# Altium project Control_Part_V1.1.PrjPcb
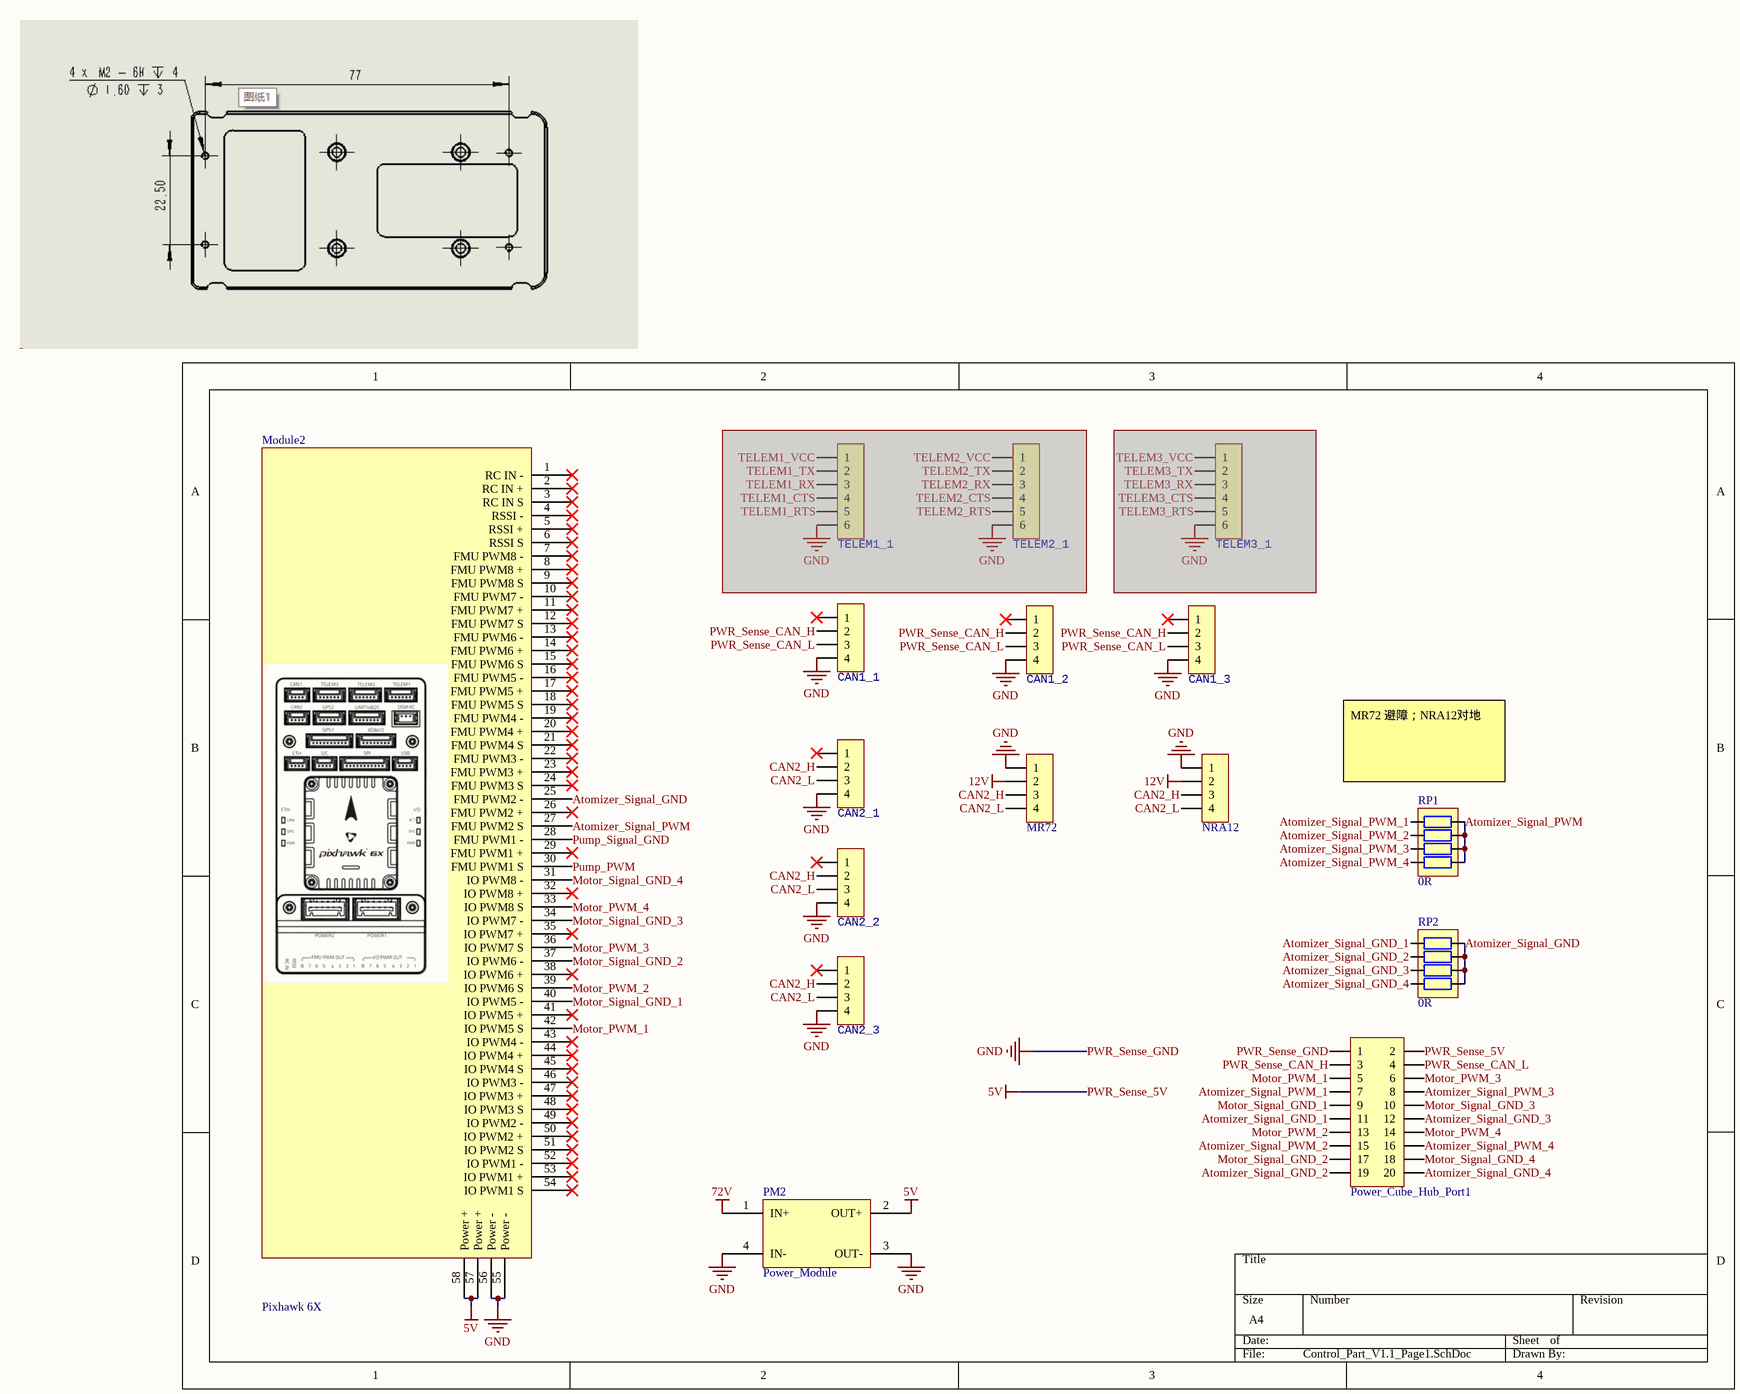
[diagram p0: Control_Part_V1.1_Page1.SchDoc]
2 sheets, 28 parts. Net scope: global (net labels, ports and power ports of the same name join across sheets).
Board file: Control_Part_V1.1.PcbDoc
Sheets:
  Control_Part_V1.1_Page1.SchDoc
  Control_Part_V1.1_Page2.SchDoc

## Sheet Control_Part_V1.1_Page1.SchDoc
size A4; SheetNumber: 1; SheetTotal: 2

### Parts
CAN1_1  HDR-1X4  [GH1.25-LS-4P]  (value not drawn)
CAN1_2  HDR-1X4  [GH1.25-LS-4P]  (value not drawn)
CAN1_3  HDR-1X4  [GH1.25-LS-4P]  (value not drawn)
CAN2_1  HDR-1X4  [GH1.25-LS-4P]  (value not drawn)
CAN2_2  HDR-1X4  [GH1.25-LS-4P]  (value not drawn)
CAN2_3  HDR-1X4  [GH1.25-LS-4P]  (value not drawn)
Module2  Pixhawk 6X  [CUAV_PixhawkV6X]
MR72  HDR-1X4  [KF350-4P]  (value not drawn)
NRA12  HDR-1X4  [KF350-4P]  (value not drawn)
PM2  Power_Module  [PCBComponent_1]
Power_Cube_Hub_Port1  Header 2X10  [IDC2.54-LI-2x10P]  (value not drawn)
RP1  0R  [RCA-8P4R-0603]
RP2  0R  [RCA-8P4R-0603]
TELEM1_1  HDR-1X6  [GH1.25-LS-6P]  (value not drawn)  (masked out: inside a compile mask, not in the netlist)
TELEM2_1  HDR-1X6  [GH1.25-LS-6P]  (value not drawn)  (masked out: inside a compile mask, not in the netlist)
TELEM3_1  HDR-1X6  [GH1.25-LS-6P]  (value not drawn)  (masked out: inside a compile mask, not in the netlist)

### Nets
12V: MR72.2 NRA12.2
72V: PM2.1(IN+)
PWR_Sense_5V: Module2.57(Power_+) Module2.58(Power_+) PM2.2(OUT+) Power_Cube_Hub_Port1.2  [also labelled 5V]
PWR_Sense_GND: CAN1_1.4 CAN1_2.4 CAN1_3.4 CAN2_1.4 CAN2_2.4 CAN2_3.4 Module2.55(Power_-) Module2.56(Power_-) MR72.1 NRA12.1 PM2.3(OUT-) PM2.4(IN-) Power_Cube_Hub_Port1.1  [also labelled GND]
Atomizer_Signal_GND: Module2.25(FMU_PWM2_-) RP2.5 RP2.6 RP2.7 RP2.8
Atomizer_Signal_GND_1: Power_Cube_Hub_Port1.11 RP2.1
Atomizer_Signal_GND_2: Power_Cube_Hub_Port1.19 RP2.2
Atomizer_Signal_GND_3: Power_Cube_Hub_Port1.12 RP2.3
Atomizer_Signal_GND_4: Power_Cube_Hub_Port1.20 RP2.4
Atomizer_Signal_PWM: Module2.27(FMU_PWM2_S) RP1.5 RP1.6 RP1.7 RP1.8
Atomizer_Signal_PWM_1: Power_Cube_Hub_Port1.7 RP1.1
Atomizer_Signal_PWM_2: Power_Cube_Hub_Port1.15 RP1.2
Atomizer_Signal_PWM_3: Power_Cube_Hub_Port1.8 RP1.3
Atomizer_Signal_PWM_4: Power_Cube_Hub_Port1.16 RP1.4
CAN2_H: CAN2_1.2 CAN2_2.2 CAN2_3.2 MR72.3 NRA12.3
CAN2_L: CAN2_1.3 CAN2_2.3 CAN2_3.3 MR72.4 NRA12.4
Motor_PWM_1: Module2.42(IO_PWM5_S) Power_Cube_Hub_Port1.5
Motor_PWM_2: Module2.39(IO_PWM6_S) Power_Cube_Hub_Port1.13
Motor_PWM_3: Module2.36(IO_PWM7_S) Power_Cube_Hub_Port1.6
Motor_PWM_4: Module2.33(IO_PWM8_S) Power_Cube_Hub_Port1.14
Motor_Signal_GND_1: Module2.40(IO_PWM5_-) Power_Cube_Hub_Port1.9
Motor_Signal_GND_2: Module2.37(IO_PWM6_-) Power_Cube_Hub_Port1.17
Motor_Signal_GND_3: Module2.34(IO_PWM7_-) Power_Cube_Hub_Port1.10
Motor_Signal_GND_4: Module2.31(IO_PWM8_-) Power_Cube_Hub_Port1.18
Pump_PWM: Module2.30(FMU_PWM1_S)
Pump_Signal_GND: Module2.28(FMU_PWM1_-)
PWR_Sense_CAN_H: CAN1_1.2 CAN1_2.2 CAN1_3.2 Power_Cube_Hub_Port1.3
PWR_Sense_CAN_L: CAN1_1.3 CAN1_2.3 CAN1_3.3 Power_Cube_Hub_Port1.4

Not connected (* = marked no-connect by the designer): CAN1_1 1*; CAN1_2 1*; CAN1_3 1*; CAN2_1 1*; CAN2_2 1*; CAN2_3 1*; Module2 1(RC_IN_-)* 2(RC_IN_+)* 3(RC_IN_S)* 4(RSSI_-)* 5(RSSI_+)* 6(RSSI_S)* 7(FMU_PWM8_-)* 8(FMU_PWM8_+)* 9(FMU_PWM8_S)* 10(FMU_PWM7_-)* 11(FMU_PWM7_+)* 12(FMU_PWM7_S)* 13(FMU_PWM6_-)* 14(FMU_PWM6_+)* 15(FMU_PWM6_S)* 16(FMU_PWM5_-)* 17(FMU_PWM5_+)* 18(FMU_PWM5_S)* 19(FMU_PWM4_-)* 20(FMU_PWM4_+)* 21(FMU_PWM4_S)* 22(FMU_PWM3_-)* 23(FMU_PWM3_+)* 24(FMU_PWM3_S)* 26(FMU_PWM2_+)* 29(FMU_PWM1_+)* 32(IO_PWM8_+)* 35(IO_PWM7_+)* 38(IO_PWM6_+)* 41(IO_PWM5_+)* 43(IO_PWM4_-)* 44(IO_PWM4_+)* 45(IO_PWM4_S)* 46(IO_PWM3_-)* 47(IO_PWM3_+)* 48(IO_PWM3_S)* 49(IO_PWM2_-)* 50(IO_PWM2_+)* 51(IO_PWM2_S)* 52(IO_PWM1_-)* 53(IO_PWM1_+)* 54(IO_PWM1_S)*

### Notes on the sheet
- (near RP1) MR72 避障；NRA12对地

### Library data of the parts
CAN1_1-CAN1_3 CAN2_1-CAN2_3 MR72 NRA12 = Header 4: 4P接插件; BOM名称: 4P接插件
Power_Cube_Hub_Port1 = Header 10X2: 10*2P接插件; BOM名称: 10*2P接插件
RP1 RP2 = R-8P4R: 贴片网络排阻; BOM名称: 贴片网络排阻
TELEM1_1 TELEM2_1 TELEM3_1 = Header 6: 6P接插件; BOM名称: 6P接插件

## Sheet Control_Part_V1.1_Page2.SchDoc
size A4; SheetNumber: 2; SheetTotal: 2
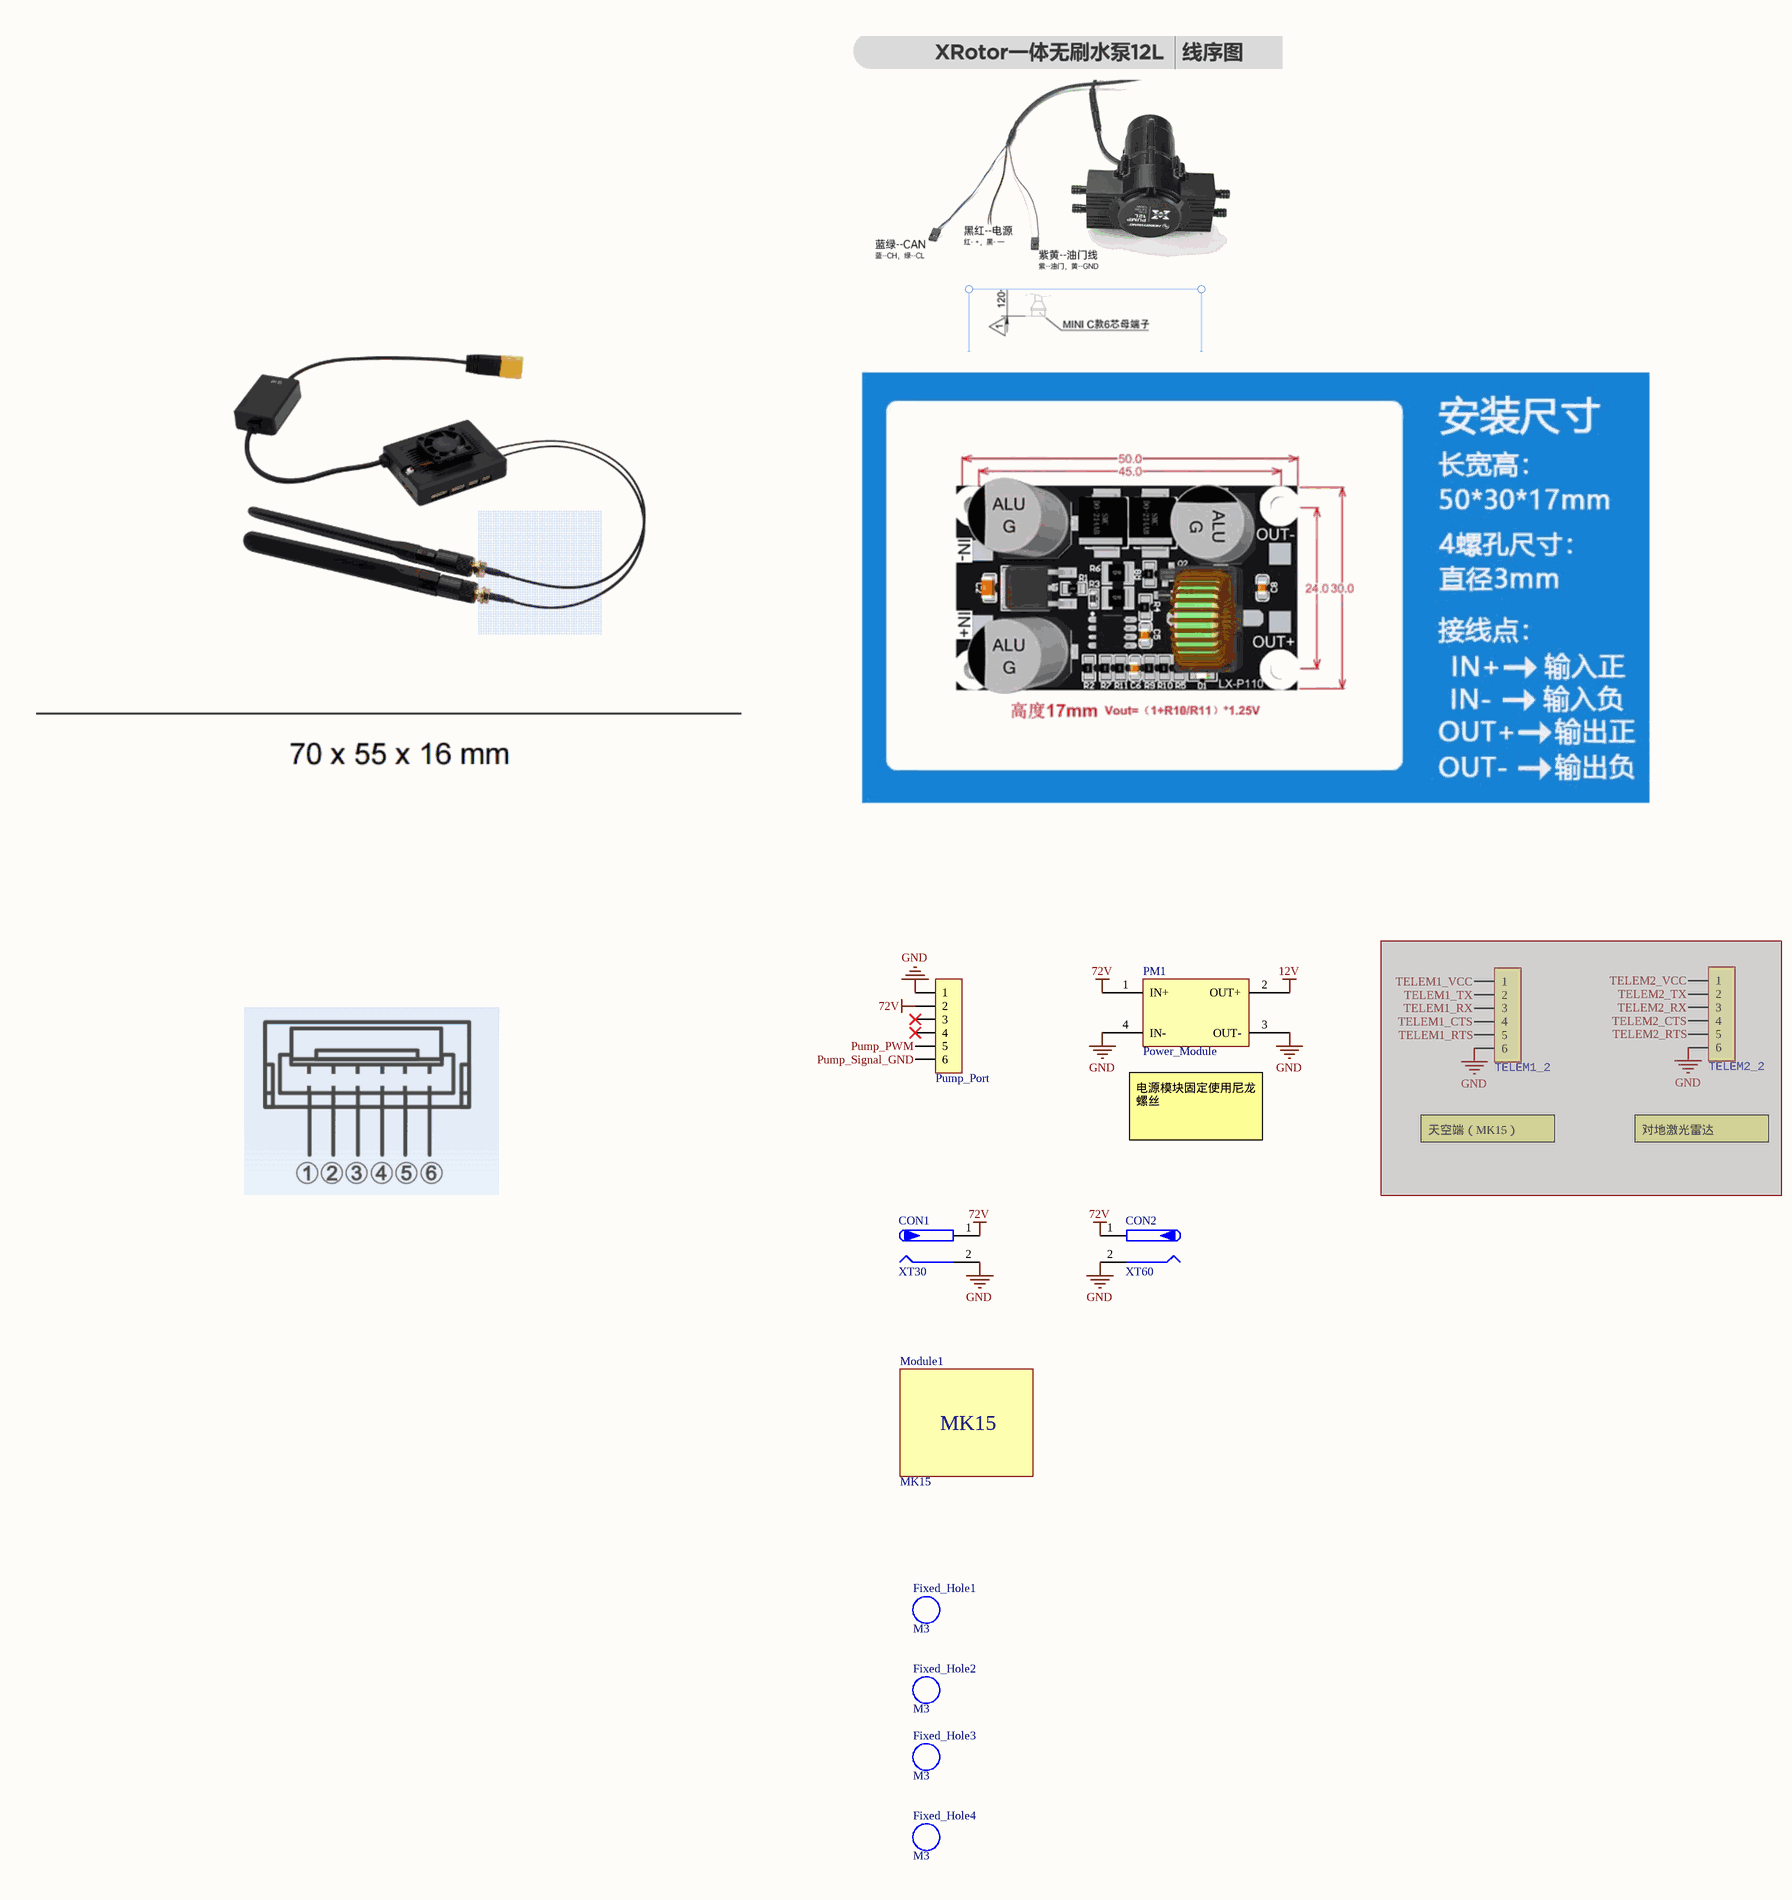
[diagram p1: Control_Part_V1.1_Page2.SchDoc, left]
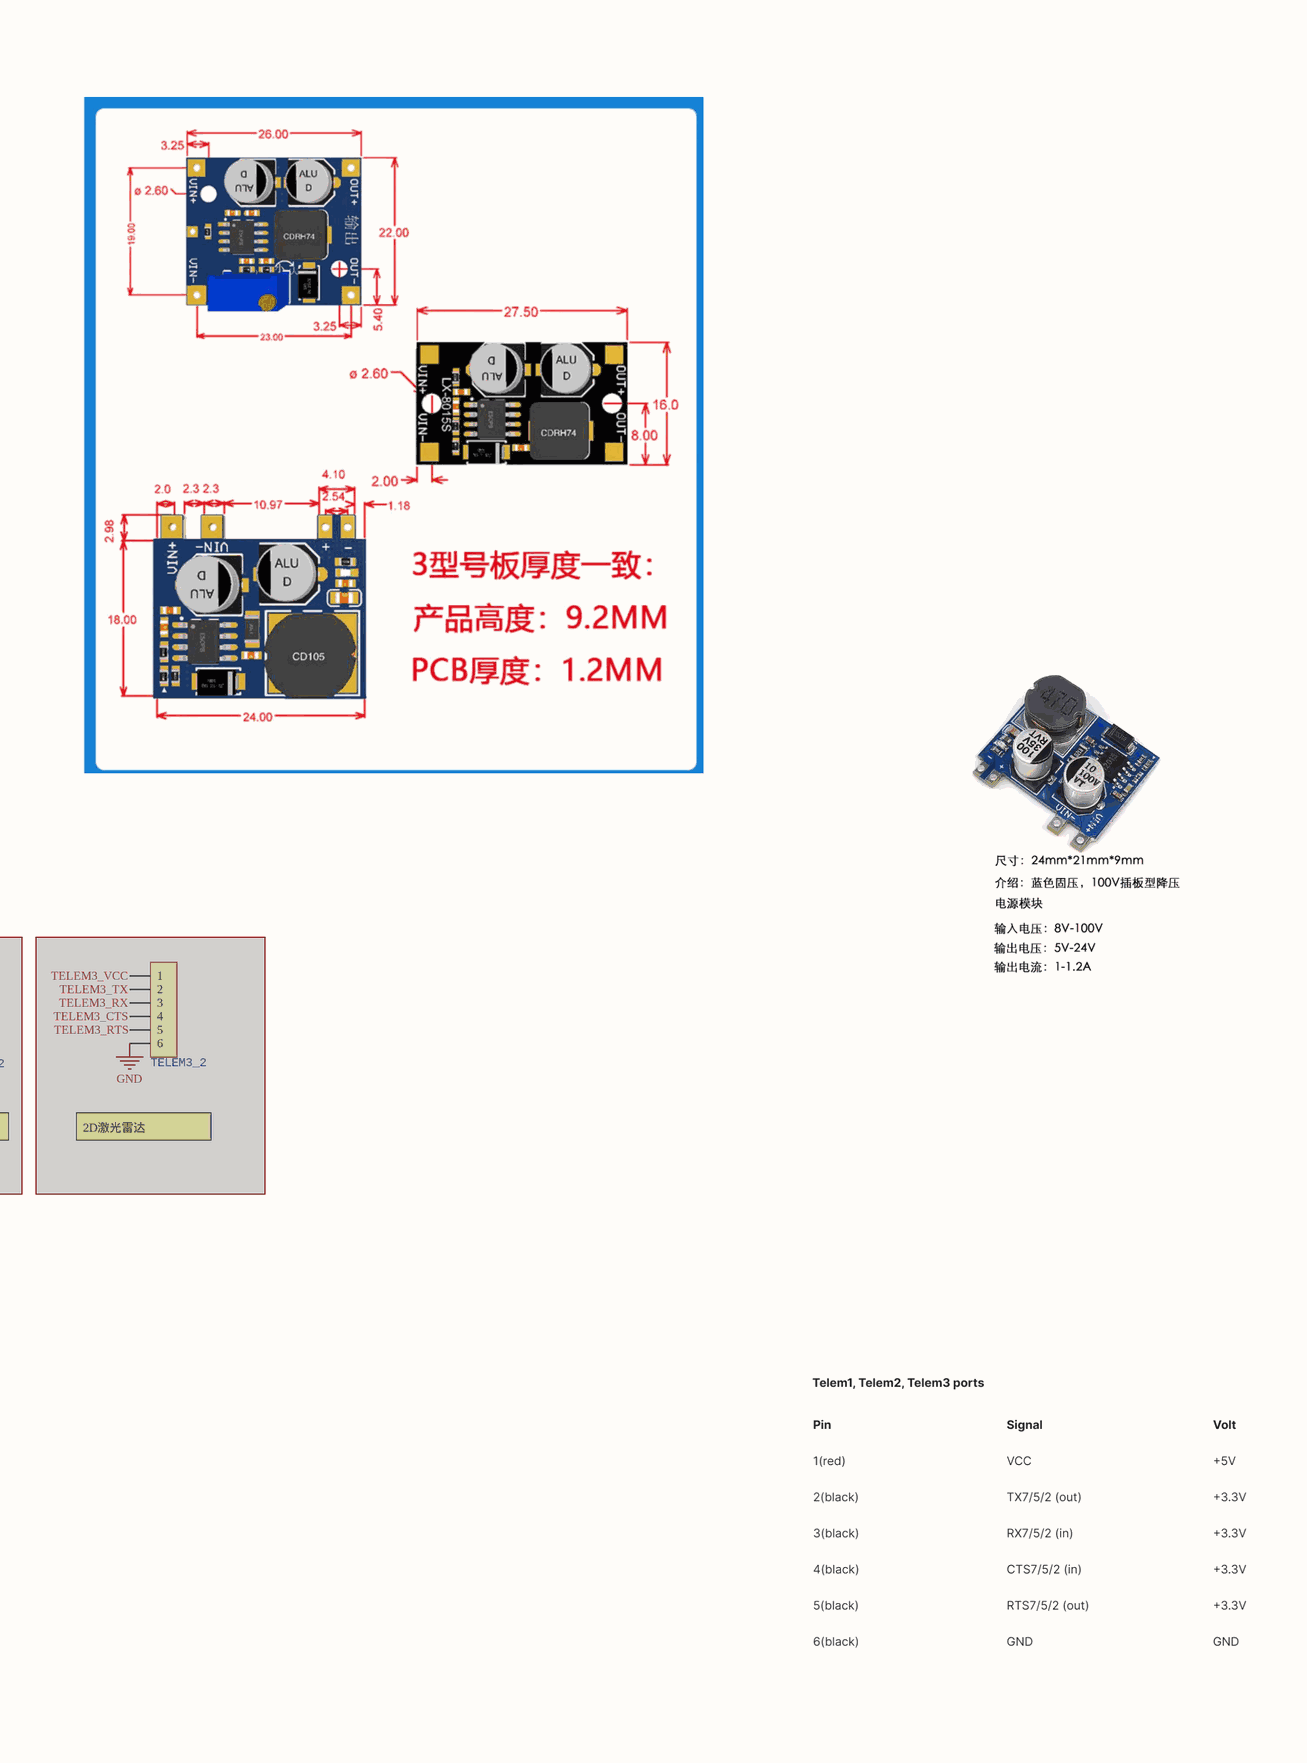
[diagram p2: Control_Part_V1.1_Page2.SchDoc, right]

### Parts
CON1  XT30  [XT30U-M]
CON2  XT60  [TX60U-F]
Fixed_Hole1  M3  [M3 140X350]
Fixed_Hole2  M3  [M3 140X350]
Fixed_Hole3  M3  [M3 140X350]
Fixed_Hole4  M3  [M3 140X350]
Module1  MK15  [MK15]
PM1  Power_Module  [PCBComponent_1]
Pump_Port  HDR-1X6  [HDR2.54-LI-6P]  (value not drawn)
TELEM1_2  HDR-1X6  [GH1.25-LS-6P]  (value not drawn)  (masked out: inside a compile mask, not in the netlist)
TELEM2_2  HDR-1X6  [GH1.25-LS-6P]  (value not drawn)  (masked out: inside a compile mask, not in the netlist)
TELEM3_2  HDR-1X6  [GH1.25-LS-6P]  (value not drawn)  (masked out: inside a compile mask, not in the netlist)

### Nets
12V: PM1.2(OUT+)
72V: CON1.1 CON2.1 PM1.1(IN+) Pump_Port.2
GND: CON1.2 CON2.2 PM1.3(OUT-) PM1.4(IN-) Pump_Port.1  [project net PWR_Sense_GND]
Pump_PWM: Pump_Port.5
Pump_Signal_GND: Pump_Port.6

Not connected (* = marked no-connect by the designer): Pump_Port 3* 4*

### Notes on the sheet
- (near PM1) 电源模块固定使用尼龙螺丝
- 天空端（MK15）
- 对地激光雷达
- 2D激光雷达

### Library data of the parts
CON1 CON2 = XT电源接口-2Pins: 电源接口; BOM名称: XT航模电源接口
Fixed_Hole1-Fixed_Hole4 = M3: 铜柱孔; BOM名称: 铜柱孔
Pump_Port TELEM1_2 TELEM2_2 TELEM3_2 = Header 6: 6P接插件; BOM名称: 6P接插件

## Nets that join several sheets
12V: Control_Part_V1.1_Page1 (MR72.2 NRA12.2), Control_Part_V1.1_Page2 (PM1.2)
72V: Control_Part_V1.1_Page1 (PM2.1), Control_Part_V1.1_Page2 (CON1.1 CON2.1 PM1.1 Pump_Port.2)
PWR_Sense_GND: Control_Part_V1.1_Page1 (13 pins), Control_Part_V1.1_Page2 (5 pins)
Pump_PWM: Control_Part_V1.1_Page1 (Module2.30), Control_Part_V1.1_Page2 (Pump_Port.5)
Pump_Signal_GND: Control_Part_V1.1_Page1 (Module2.28), Control_Part_V1.1_Page2 (Pump_Port.6)